# EAGLE schematic Iluminacion_LED (EAGLE 9.6.0)
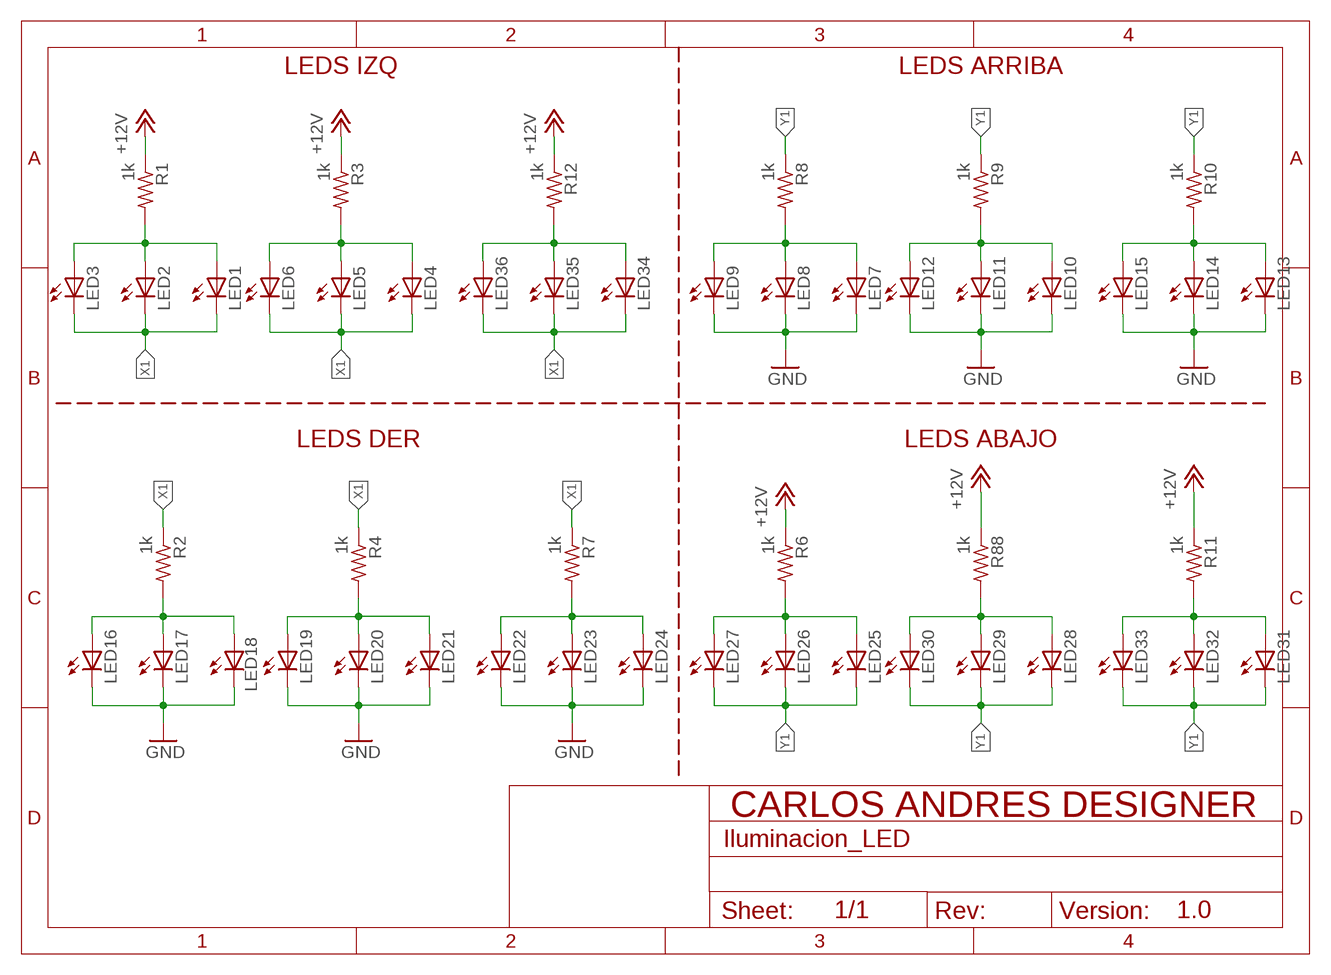
[diagram p0: schematic, sheet 1]

## Parts
LED1  LED-BLANCO5730  [LED5730-BLANCO]
LED2  LED-BLANCO5730  [LED5730-BLANCO]
LED3  LED-BLANCO5730  [LED5730-BLANCO]
LED4  LED-BLANCO5730  [LED5730-BLANCO]
LED5  LED-BLANCO5730  [LED5730-BLANCO]
LED6  LED-BLANCO5730  [LED5730-BLANCO]
LED7  LED-BLANCO5730  [LED5730-BLANCO]
LED8  LED-BLANCO5730  [LED5730-BLANCO]
LED9  LED-BLANCO5730  [LED5730-BLANCO]
LED10  LED-BLANCO5730  [LED5730-BLANCO]
LED11  LED-BLANCO5730  [LED5730-BLANCO]
LED12  LED-BLANCO5730  [LED5730-BLANCO]
LED13  LED-BLANCO5730  [LED5730-BLANCO]
LED14  LED-BLANCO5730  [LED5730-BLANCO]
LED15  LED-BLANCO5730  [LED5730-BLANCO]
LED16  LED-BLANCO5730  [LED5730-BLANCO]
LED17  LED-BLANCO5730  [LED5730-BLANCO]
LED18  LED-BLANCO5730  [LED5730-BLANCO]
LED19  LED-BLANCO5730  [LED5730-BLANCO]
LED20  LED-BLANCO5730  [LED5730-BLANCO]
LED21  LED-BLANCO5730  [LED5730-BLANCO]
LED22  LED-BLANCO5730  [LED5730-BLANCO]
LED23  LED-BLANCO5730  [LED5730-BLANCO]
LED24  LED-BLANCO5730  [LED5730-BLANCO]
LED25  LED-BLANCO5730  [LED5730-BLANCO]
LED26  LED-BLANCO5730  [LED5730-BLANCO]
LED27  LED-BLANCO5730  [LED5730-BLANCO]
LED28  LED-BLANCO5730  [LED5730-BLANCO]
LED29  LED-BLANCO5730  [LED5730-BLANCO]
LED30  LED-BLANCO5730  [LED5730-BLANCO]
LED31  LED-BLANCO5730  [LED5730-BLANCO]
LED32  LED-BLANCO5730  [LED5730-BLANCO]
LED33  LED-BLANCO5730  [LED5730-BLANCO]
LED34  LED-BLANCO5730  [LED5730-BLANCO]
LED35  LED-BLANCO5730  [LED5730-BLANCO]
LED36  LED-BLANCO5730  [LED5730-BLANCO]
R1  1k  RESISTOR_R0805  [R0805]
R2  1k  RESISTOR_R0805  [R0805]
R3  1k  RESISTOR_R0805  [R0805]
R4  1k  RESISTOR_R0805  [R0805]
R6  1k  RESISTOR_R0805  [R0805]
R7  1k  RESISTOR_R0805  [R0805]
R8  1k  RESISTOR_R0805  [R0805]
R9  1k  RESISTOR_R0805  [R0805]
R10  1k  RESISTOR_R0805  [R0805]
R11  1k  RESISTOR_R0805  [R0805]
R12  1k  RESISTOR_R0805  [R0805]
R88  1k  RESISTOR_R0805  [R0805]

## Nets
+12V: R1.1 R3.1 R6.1 R11.1 R12.1 R88.1
GND: LED7.C LED8.C LED9.C LED10.C LED11.C LED12.C LED13.C LED14.C LED15.C LED16.C LED17.C LED18.C LED19.C LED20.C LED21.C LED22.C LED23.C LED24.C
N$1: LED22.A LED23.A LED24.A R7.2
N$2: LED16.A LED17.A LED18.A R2.2
N$3: LED1.A LED2.A LED3.A R1.2
N$4: LED4.A LED5.A LED6.A R3.2
N$5: LED19.A LED20.A LED21.A R4.2
N$6: LED25.A LED26.A LED27.A R6.2
N$7: LED7.A LED8.A LED9.A R8.2
N$8: LED10.A LED11.A LED12.A R9.2
N$9: LED28.A LED29.A LED30.A R88.2
N$10: LED34.A LED35.A LED36.A R12.2
N$11: LED13.A LED14.A LED15.A R10.2
N$12: LED31.A LED32.A LED33.A R11.2
N$15: R10.1
X1: LED1.C LED2.C LED3.C LED4.C LED5.C LED6.C LED34.C LED35.C LED36.C R2.1 R4.1 R7.1
Y1: LED25.C LED26.C LED27.C LED28.C LED29.C LED30.C LED31.C LED32.C LED33.C R8.1 R9.1

## Notes on the sheet
- LEDS IZQ | LEDS ARRIBA
- LEDS DER | LEDS ABAJO
- 1.0

## Library data of the parts
LED1-LED36 = CaliBeta-Diodos:LED-BLANCO: LED SMD Imax:20mA, color Blanco
R1-R4 R6-R12 R88 = CaliBeta-RCL:RESISTOR_: RESISTOR, simbolo Americano